# Altium project FIT_PM_Dual_Range_AFE.PrjPcb (part 7 of 8)

## Sheet FPGA_.SchDoc: FMC DAC 1.5GS 4CH
size 420 x 297 mm; Author: G.Kasprowicz; CompanyName: WUT ISE; DrawnBy: G.Kasprowicz; Organization: WUT ISE; Address1: PW ISE; Address2: Nowowiejska 15/19 00-665 Warsaw; Address3: gkasprow@gmail.com; Revision: 1; SheetNumber: 19; SheetTotal: 21; ModifiedBy: -; CheckedDate: -; Title2: FMC; DivGrp: WUT ISE; Designer: G.Kasprowicz; ModifiedDate: -; ProjectName: Sensor Box
Used 2 times, as channels U_FPGA_1, U_FPGA_2. Parts and nets are listed once, with the designators drawn on the sheet.
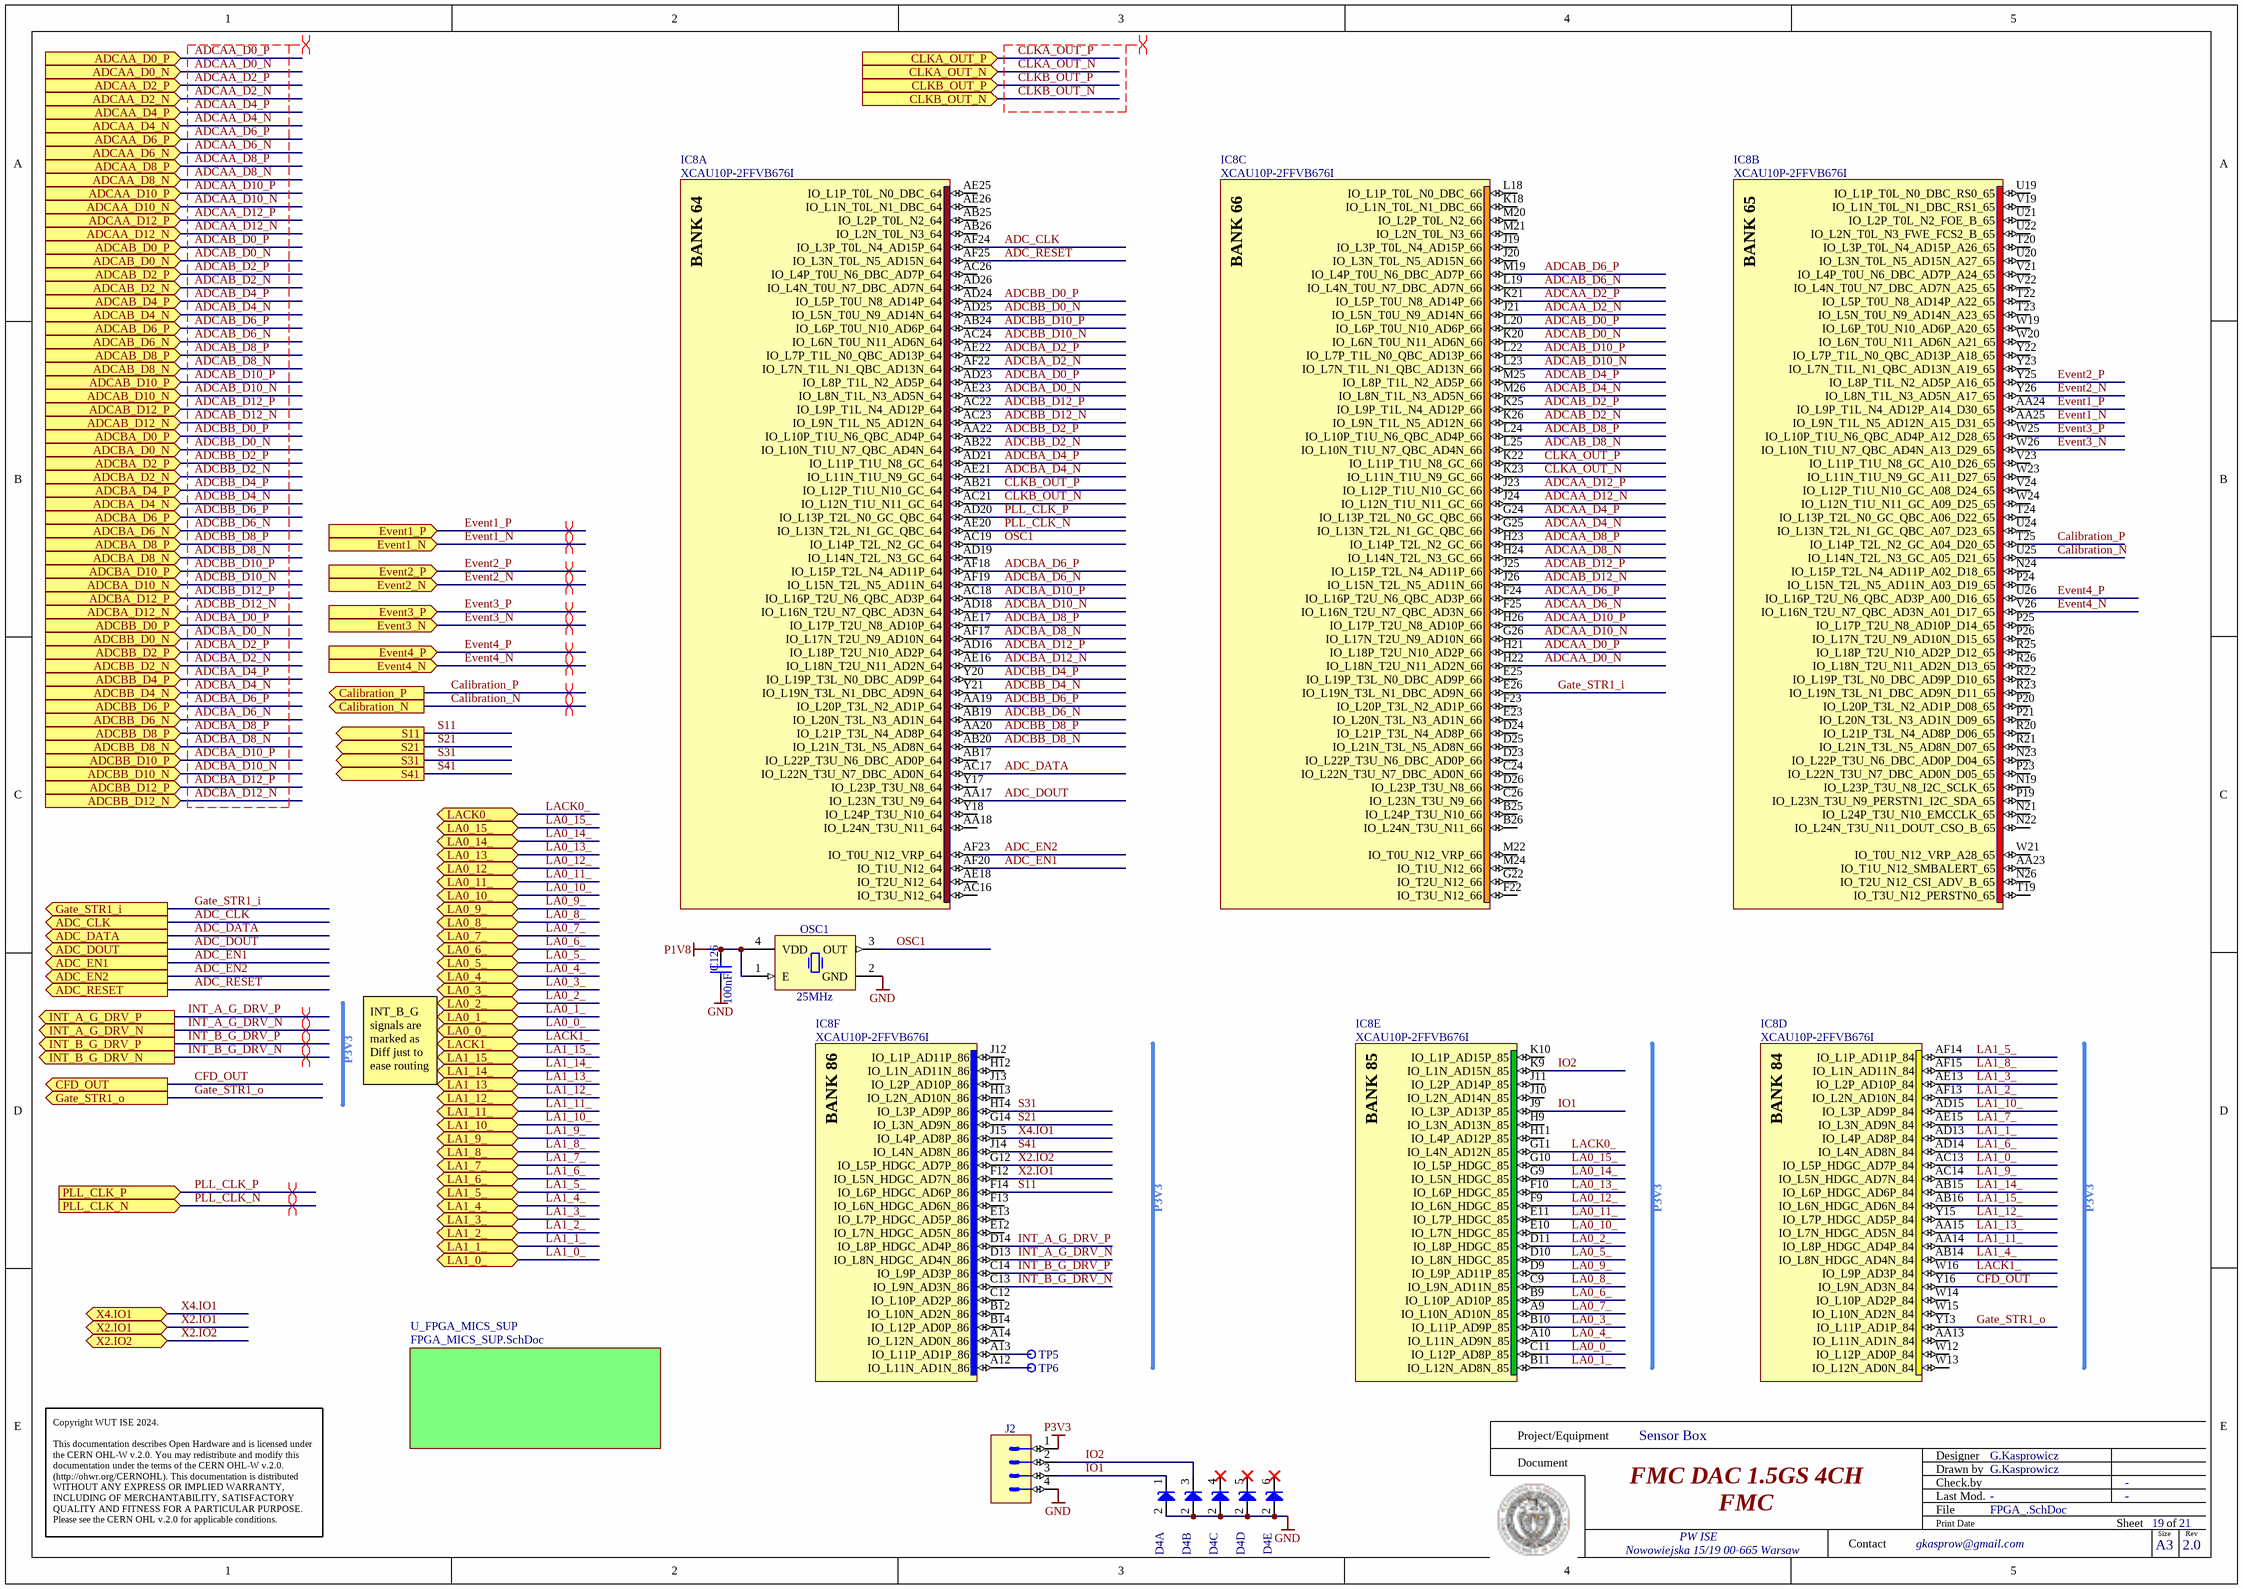
[diagram p19: FPGA_.SchDoc]

### Parts
C126  100nF  [CAPC1005X55N]
D4  PESD3V3L5UY  [SOT65P210X110-6N]  (value not drawn)  (parts A,B,C,D,E of 5)
IC8  XCAU10P-2FFVB676I  [BGA676C100P26X26_2700X2700X350]  (parts A,B,C,D,E,F of 13)
J2  Header 4  [SAMTEC_TSW-104-07-L-S-LL]  (value not drawn)
OSC1  25MHz  [OSC_ECS_ECS-3518]
TP5  Test Point  [TPS127]  (value not drawn)
TP6  Test Point  [TPS127]  (value not drawn)

### Sub-sheets
U_FPGA_MICS_SUP = FPGA_MICS_SUP.SchDoc: no entries

### Ports
ADC_CLK (out), ADC_DATA (out), ADC_DOUT (out), ADC_EN1 (out), ADC_EN2 (out), ADC_RESET (out), ADCAA_D0_N (in), ADCAA_D0_P (in), ADCAA_D2_N (in), ADCAA_D2_P (in), ADCAA_D4_N (in), ADCAA_D4_P (in), ADCAA_D6_N (in), ADCAA_D6_P (in), ADCAA_D8_N (in), ADCAA_D8_P (in), ADCAA_D10_N (in), ADCAA_D10_P (in), ADCAA_D12_N (in), ADCAA_D12_P (in), ADCAB_D0_N (in), ADCAB_D0_P (in), ADCAB_D2_N (in), ADCAB_D2_P (in), ADCAB_D4_N (in), ADCAB_D4_P (in), ADCAB_D6_N (in), ADCAB_D6_P (in), ADCAB_D8_N (in), ADCAB_D8_P (in), ADCAB_D10_N (in), ADCAB_D10_P (in), ADCAB_D12_N (in), ADCAB_D12_P (in), ADCBA_D0_N (in), ADCBA_D0_P (in), ADCBA_D2_N (in), ADCBA_D2_P (in), ADCBA_D4_N (in), ADCBA_D4_P (in), ADCBA_D6_N (in), ADCBA_D6_P (in), ADCBA_D8_N (in), ADCBA_D8_P (in), ADCBA_D10_N (in), ADCBA_D10_P (in), ADCBA_D12_N (in), ADCBA_D12_P (in), ADCBB_D0_N (in), ADCBB_D0_P (in), ADCBB_D2_N (in), ADCBB_D2_P (in), ADCBB_D4_N (in), ADCBB_D4_P (in), ADCBB_D6_N (in), ADCBB_D6_P (in), ADCBB_D8_N (in), ADCBB_D8_P (in), ADCBB_D10_N (in), ADCBB_D10_P (in), ADCBB_D12_N (in), ADCBB_D12_P (in), Calibration_N (out), Calibration_P (out), CFD_OUT (out), CLKA_OUT_N (in), CLKA_OUT_P (in), CLKB_OUT_N (in), CLKB_OUT_P (in), Event1_N (in), Event1_P (in), Event2_N (in), Event2_P (in), Event3_N (in), Event3_P (in), Event4_N (in), Event4_P (in), Gate_STR1_i (out), Gate_STR1_o (out), INT_A_G_DRV_N (out), INT_A_G_DRV_P (out), INT_B_G_DRV_N (out), INT_B_G_DRV_P (out), LA0_0_ (bidir), LA0_1_ (bidir), LA0_2_ (bidir), LA0_3_ (bidir), LA0_4_ (bidir), LA0_5_ (bidir), LA0_6_ (bidir), LA0_7_ (bidir), LA0_8_ (bidir), LA0_9_ (bidir), LA0_10_ (bidir), LA0_11_ (bidir), LA0_12_ (bidir), LA0_13_ (bidir), LA0_14_ (bidir), LA0_15_ (bidir), LA1_0_ (bidir), LA1_1_ (bidir), LA1_2_ (bidir), LA1_3_ (bidir), LA1_4_ (bidir), LA1_5_ (bidir), LA1_6_ (bidir), LA1_7_ (bidir), LA1_8_ (bidir), LA1_9_ (bidir), LA1_10_ (bidir), LA1_11_ (bidir), LA1_12_ (bidir), LA1_13_ (bidir), LA1_14_ (bidir), LA1_15_ (bidir), LACK0_ (bidir), LACK1_ (bidir), PLL_CLK_N (in), PLL_CLK_P (in), S11 (out), S21 (out), S31 (out), S41 (out), X2.IO1 (bidir), X2.IO2 (bidir), X4.IO1 (bidir)

### Nets
GND: C126.1 D4.2(A) J2.4 OSC1.2(GND)
P1V8: C126.2 OSC1.1(E) OSC1.4(VDD)
P3V3: J2.1
ADC_CLK: IC8.AF24(IO_L3P_T0L_N4_AD15P_64) ; port ADC_CLK
ADC_DATA: IC8.AC17(IO_L22N_T3U_N7_DBC_AD0N_64) ; port ADC_DATA
ADC_DOUT: IC8.AA17(IO_L23N_T3U_N9_64) ; port ADC_DOUT
ADC_EN1: IC8.AF20(IO_T1U_N12_64) ; port ADC_EN1
ADC_EN2: IC8.AF23(IO_T0U_N12_VRP_64) ; port ADC_EN2
ADC_RESET: IC8.AF25(IO_L3N_T0L_N5_AD15N_64) ; port ADC_RESET
ADCAA_D0_N: IC8.H22(IO_L18N_T2U_N11_AD2N_66) ; port ADCAA_D0_N
ADCAA_D0_P: IC8.H21(IO_L18P_T2U_N10_AD2P_66) ; port ADCAA_D0_P
ADCAA_D2_N: IC8.J21(IO_L5N_T0U_N9_AD14N_66) ; port ADCAA_D2_N
ADCAA_D2_P: IC8.K21(IO_L5P_T0U_N8_AD14P_66) ; port ADCAA_D2_P
ADCAA_D4_N: IC8.G25(IO_L13N_T2L_N1_GC_QBC_66) ; port ADCAA_D4_N
ADCAA_D4_P: IC8.G24(IO_L13P_T2L_N0_GC_QBC_66) ; port ADCAA_D4_P
ADCAA_D6_N: IC8.F25(IO_L16N_T2U_N7_QBC_AD3N_66) ; port ADCAA_D6_N
ADCAA_D6_P: IC8.F24(IO_L16P_T2U_N6_QBC_AD3P_66) ; port ADCAA_D6_P
ADCAA_D8_N: IC8.H24(IO_L14N_T2L_N3_GC_66) ; port ADCAA_D8_N
ADCAA_D8_P: IC8.H23(IO_L14P_T2L_N2_GC_66) ; port ADCAA_D8_P
ADCAA_D10_N: IC8.G26(IO_L17N_T2U_N9_AD10N_66) ; port ADCAA_D10_N
ADCAA_D10_P: IC8.H26(IO_L17P_T2U_N8_AD10P_66) ; port ADCAA_D10_P
ADCAA_D12_N: IC8.J24(IO_L12N_T1U_N11_GC_66) ; port ADCAA_D12_N
ADCAA_D12_P: IC8.J23(IO_L12P_T1U_N10_GC_66) ; port ADCAA_D12_P
ADCAB_D0_N: IC8.K20(IO_L6N_T0U_N11_AD6N_66) ; port ADCAB_D0_N
ADCAB_D0_P: IC8.L20(IO_L6P_T0U_N10_AD6P_66) ; port ADCAB_D0_P
ADCAB_D2_N: IC8.K26(IO_L9N_T1L_N5_AD12N_66) ; port ADCAB_D2_N
ADCAB_D2_P: IC8.K25(IO_L9P_T1L_N4_AD12P_66) ; port ADCAB_D2_P
ADCAB_D4_N: IC8.M26(IO_L8N_T1L_N3_AD5N_66) ; port ADCAB_D4_N
ADCAB_D4_P: IC8.M25(IO_L8P_T1L_N2_AD5P_66) ; port ADCAB_D4_P
ADCAB_D6_N: IC8.L19(IO_L4N_T0U_N7_DBC_AD7N_66) ; port ADCAB_D6_N
ADCAB_D6_P: IC8.M19(IO_L4P_T0U_N6_DBC_AD7P_66) ; port ADCAB_D6_P
ADCAB_D8_N: IC8.L25(IO_L10N_T1U_N7_QBC_AD4N_66) ; port ADCAB_D8_N
ADCAB_D8_P: IC8.L24(IO_L10P_T1U_N6_QBC_AD4P_66) ; port ADCAB_D8_P
ADCAB_D10_N: IC8.L23(IO_L7N_T1L_N1_QBC_AD13N_66) ; port ADCAB_D10_N
ADCAB_D10_P: IC8.L22(IO_L7P_T1L_N0_QBC_AD13P_66) ; port ADCAB_D10_P
ADCAB_D12_N: IC8.J26(IO_L15N_T2L_N5_AD11N_66) ; port ADCAB_D12_N
ADCAB_D12_P: IC8.J25(IO_L15P_T2L_N4_AD11P_66) ; port ADCAB_D12_P
ADCBA_D0_N: IC8.AE23(IO_L8N_T1L_N3_AD5N_64) ; port ADCBB_D0_N
ADCBA_D0_P: IC8.AD23(IO_L8P_T1L_N2_AD5P_64) ; port ADCBB_D0_P
ADCBA_D2_N: IC8.AF22(IO_L7N_T1L_N1_QBC_AD13N_64) ; port ADCBB_D2_N
ADCBA_D2_P: IC8.AE22(IO_L7P_T1L_N0_QBC_AD13P_64) ; port ADCBB_D2_P
ADCBA_D4_N: IC8.AE21(IO_L11N_T1U_N9_GC_64) ; port ADCBB_D4_N
ADCBA_D4_P: IC8.AD21(IO_L11P_T1U_N8_GC_64) ; port ADCBB_D4_P
ADCBA_D6_N: IC8.AF19(IO_L15N_T2L_N5_AD11N_64) ; port ADCBB_D6_N
ADCBA_D6_P: IC8.AF18(IO_L15P_T2L_N4_AD11P_64) ; port ADCBB_D6_P
ADCBA_D8_N: IC8.AF17(IO_L17N_T2U_N9_AD10N_64) ; port ADCBB_D8_N
ADCBA_D8_P: IC8.AE17(IO_L17P_T2U_N8_AD10P_64) ; port ADCBB_D8_P
ADCBA_D10_N: IC8.AD18(IO_L16N_T2U_N7_QBC_AD3N_64) ; port ADCBB_D10_N
ADCBA_D10_P: IC8.AC18(IO_L16P_T2U_N6_QBC_AD3P_64) ; port ADCBB_D10_P
ADCBA_D12_N: IC8.AE16(IO_L18N_T2U_N11_AD2N_64) ; port ADCBB_D12_N
ADCBA_D12_P: IC8.AD16(IO_L18P_T2U_N10_AD2P_64) ; port ADCBB_D12_P
ADCBB_D0_N: IC8.AD25(IO_L5N_T0U_N9_AD14N_64) ; port ADCBA_D0_N
ADCBB_D0_P: IC8.AD24(IO_L5P_T0U_N8_AD14P_64) ; port ADCBA_D0_P
ADCBB_D2_N: IC8.AB22(IO_L10N_T1U_N7_QBC_AD4N_64) ; port ADCBA_D2_N
ADCBB_D2_P: IC8.AA22(IO_L10P_T1U_N6_QBC_AD4P_64) ; port ADCBA_D2_P
ADCBB_D4_N: IC8.Y21(IO_L19N_T3L_N1_DBC_AD9N_64) ; port ADCBA_D4_N
ADCBB_D4_P: IC8.Y20(IO_L19P_T3L_N0_DBC_AD9P_64) ; port ADCBA_D4_P
ADCBB_D6_N: IC8.AB19(IO_L20N_T3L_N3_AD1N_64) ; port ADCBA_D6_N
ADCBB_D6_P: IC8.AA19(IO_L20P_T3L_N2_AD1P_64) ; port ADCBA_D6_P
ADCBB_D8_N: IC8.AB20(IO_L21N_T3L_N5_AD8N_64) ; port ADCBA_D8_N
ADCBB_D8_P: IC8.AA20(IO_L21P_T3L_N4_AD8P_64) ; port ADCBA_D8_P
ADCBB_D10_N: IC8.AC24(IO_L6N_T0U_N11_AD6N_64) ; port ADCBA_D10_N
ADCBB_D10_P: IC8.AB24(IO_L6P_T0U_N10_AD6P_64) ; port ADCBA_D10_P
ADCBB_D12_N: IC8.AC23(IO_L9N_T1L_N5_AD12N_64) ; port ADCBA_D12_N
ADCBB_D12_P: IC8.AC22(IO_L9P_T1L_N4_AD12P_64) ; port ADCBA_D12_P
Calibration_N: IC8.U25(IO_L14N_T2L_N3_GC_A05_D21_65) ; port Calibration_N
Calibration_P: IC8.T25(IO_L14P_T2L_N2_GC_A04_D20_65) ; port Calibration_P
CFD_OUT: IC8.Y16(IO_L9N_AD3N_84) ; port CFD_OUT
CLKA_OUT_N: IC8.K23(IO_L11N_T1U_N9_GC_66) ; port CLKA_OUT_N
CLKA_OUT_P: IC8.K22(IO_L11P_T1U_N8_GC_66) ; port CLKA_OUT_P
CLKB_OUT_N: IC8.AC21(IO_L12N_T1U_N11_GC_64) ; port CLKB_OUT_N
CLKB_OUT_P: IC8.AB21(IO_L12P_T1U_N10_GC_64) ; port CLKB_OUT_P
Event1_N: IC8.AA25(IO_L9N_T1L_N5_AD12N_A15_D31_65) ; port Event1_N
Event1_P: IC8.AA24(IO_L9P_T1L_N4_AD12P_A14_D30_65) ; port Event1_P
Event2_N: IC8.Y26(IO_L8N_T1L_N3_AD5N_A17_65) ; port Event2_N
Event2_P: IC8.Y25(IO_L8P_T1L_N2_AD5P_A16_65) ; port Event2_P
Event3_N: IC8.W26(IO_L10N_T1U_N7_QBC_AD4N_A13_D29_65) ; port Event3_N
Event3_P: IC8.W25(IO_L10P_T1U_N6_QBC_AD4P_A12_D28_65) ; port Event3_P
Event4_N: IC8.V26(IO_L16N_T2U_N7_QBC_AD3N_A01_D17_65) ; port Event4_N
Event4_P: IC8.U26(IO_L16P_T2U_N6_QBC_AD3P_A00_D16_65) ; port Event4_P
Gate_STR1_i: IC8.E26(IO_L19N_T3L_N1_DBC_AD9N_66) ; port Gate_STR1_i
Gate_STR1_o: IC8.Y13(IO_L11P_AD1P_84) ; port Gate_STR1_o
INT_A_G_DRV_N: IC8.D13(IO_L8N_HDGC_AD4N_86) ; port INT_A_G_DRV_N
INT_A_G_DRV_P: IC8.D14(IO_L8P_HDGC_AD4P_86) ; port INT_A_G_DRV_P
INT_B_G_DRV_N: IC8.C13(IO_L9N_AD3N_86) ; port INT_B_G_DRV_N
INT_B_G_DRV_P: IC8.C14(IO_L9P_AD3P_86) ; port INT_B_G_DRV_P
IO1: D4.1(C) IC8.J9(IO_L3P_AD13P_85) J2.3
IO2: D4.3(C) IC8.K9(IO_L1N_AD15N_85) J2.2
LA0_0_: IC8.C11(IO_L12P_AD8P_85) ; port LA0_0_
LA0_1_: IC8.B11(IO_L12N_AD8N_85) ; port LA0_1_
LA0_2_: IC8.D11(IO_L8P_HDGC_85) ; port LA0_2_
LA0_3_: IC8.B10(IO_L11P_AD9P_85) ; port LA0_3_
LA0_4_: IC8.A10(IO_L11N_AD9N_85) ; port LA0_4_
LA0_5_: IC8.D10(IO_L8N_HDGC_85) ; port LA0_5_
LA0_6_: IC8.B9(IO_L10P_AD10P_85) ; port LA0_6_
LA0_7_: IC8.A9(IO_L10N_AD10N_85) ; port LA0_7_
LA0_8_: IC8.C9(IO_L9N_AD11N_85) ; port LA0_8_
LA0_9_: IC8.D9(IO_L9P_AD11P_85) ; port LA0_9_
LA0_10_: IC8.E10(IO_L7N_HDGC_85) ; port LA0_10_
LA0_11_: IC8.E11(IO_L7P_HDGC_85) ; port LA0_11_
LA0_12_: IC8.F9(IO_L6N_HDGC_85) ; port LA0_12_
LA0_13_: IC8.F10(IO_L6P_HDGC_85) ; port LA0_13_
LA0_14_: IC8.G9(IO_L5N_HDGC_85) ; port LA0_14_
LA0_15_: IC8.G10(IO_L5P_HDGC_85) ; port LA0_15_
LA1_0_: IC8.AC13(IO_L5P_HDGC_AD7P_84) ; port LA1_0_
LA1_1_: IC8.AD13(IO_L4P_AD8P_84) ; port LA1_1_
LA1_2_: IC8.AF13(IO_L2N_AD10N_84) ; port LA1_2_
LA1_3_: IC8.AE13(IO_L2P_AD10P_84) ; port LA1_3_
LA1_4_: IC8.AB14(IO_L8N_HDGC_AD4N_84) ; port LA1_4_
LA1_5_: IC8.AF14(IO_L1P_AD11P_84) ; port LA1_5_
LA1_6_: IC8.AD14(IO_L4N_AD8N_84) ; port LA1_6_
LA1_7_: IC8.AE15(IO_L3N_AD9N_84) ; port LA1_7_
LA1_8_: IC8.AF15(IO_L1N_AD11N_84) ; port LA1_8_
LA1_9_: IC8.AC14(IO_L5N_HDGC_AD7N_84) ; port LA1_9_
LA1_10_: IC8.AD15(IO_L3P_AD9P_84) ; port LA1_10_
LA1_11_: IC8.AA14(IO_L8P_HDGC_AD4P_84) ; port LA1_11_
LA1_12_: IC8.Y15(IO_L7P_HDGC_AD5P_84) ; port LA1_12_
LA1_13_: IC8.AA15(IO_L7N_HDGC_AD5N_84) ; port LA1_13_
LA1_14_: IC8.AB15(IO_L6P_HDGC_AD6P_84) ; port LA1_14_
LA1_15_: IC8.AB16(IO_L6N_HDGC_AD6N_84) ; port LA1_15_
LACK0_: IC8.G11(IO_L4N_AD12N_85) ; port LACK0_
LACK1_: IC8.W16(IO_L9P_AD3P_84) ; port LACK1_
OSC1: IC8.AC19(IO_L14P_T2L_N2_GC_64) OSC1.3(OUT)
PLL_CLK_N: IC8.AE20(IO_L13N_T2L_N1_GC_QBC_64) ; port PLL_CLK_N
PLL_CLK_P: IC8.AD20(IO_L13P_T2L_N0_GC_QBC_64) ; port PLL_CLK_P
S11: IC8.F14(IO_L6P_HDGC_AD6P_86) ; port S11
S21: IC8.G14(IO_L3N_AD9N_86) ; port S21
S31: IC8.H14(IO_L3P_AD9P_86) ; port S31
S41: IC8.J14(IO_L4N_AD8N_86) ; port S41
X2.IO1: IC8.F12(IO_L5N_HDGC_AD7N_86) ; port X2.IO1
X2.IO2: IC8.G12(IO_L5P_HDGC_AD7P_86) ; port X2.IO2
X4.IO1: IC8.J15(IO_L4P_AD8P_86) ; port X4.IO1
NetIC8_A12: IC8.A12(IO_L11N_AD1N_86) TP6.1
NetIC8_A13: IC8.A13(IO_L11P_AD1P_86) TP5.1

Not connected (* = marked no-connect by the designer): D4 4(C)* 5(C)* 6(C)*; IC8 A14(IO_L12N_AD0N_86) AA13(IO_L11N_AD1N_84) AA18(IO_L24N_T3U_N11_64) AA23(IO_T1U_N12_SMBALERT_65) AB17(IO_L22P_T3U_N6_DBC_AD0P_64) AB25(IO_L2P_T0L_N2_64) AB26(IO_L2N_T0L_N3_64) AC16(IO_T3U_N12_64) AC26(IO_L4P_T0U_N6_DBC_AD7P_64) AD19(IO_L14N_T2L_N3_GC_64) AD26(IO_L4N_T0U_N7_DBC_AD7N_64) AE18(IO_T2U_N12_64) AE25(IO_L1P_T0L_N0_DBC_64) AE26(IO_L1N_T0L_N1_DBC_64) B12(IO_L10N_AD2N_86) B14(IO_L12P_AD0P_86) B25(IO_L24P_T3U_N10_66) B26(IO_L24N_T3U_N11_66) C12(IO_L10P_AD2P_86) C24(IO_L22N_T3U_N7_DBC_AD0N_66) C26(IO_L23N_T3U_N9_66) D23(IO_L22P_T3U_N6_DBC_AD0P_66) D24(IO_L21P_T3L_N4_AD8P_66) D25(IO_L21N_T3L_N5_AD8N_66) D26(IO_L23P_T3U_N8_66) E12(IO_L7N_HDGC_AD5N_86) E13(IO_L7P_HDGC_AD5P_86) E23(IO_L20N_T3L_N3_AD1N_66) E25(IO_L19P_T3L_N0_DBC_AD9P_66) F13(IO_L6N_HDGC_AD6N_86) F22(IO_T3U_N12_66) F23(IO_L20P_T3L_N2_AD1P_66) G22(IO_T2U_N12_66) H9(IO_L3N_AD13N_85) H11(IO_L4P_AD12P_85) H12(IO_L1N_AD11N_86) H13(IO_L2N_AD10N_86) J10(IO_L2N_AD14N_85) J11(IO_L2P_AD14P_85) J12(IO_L1P_AD11P_86) J13(IO_L2P_AD10P_86) J19(IO_L3P_T0L_N4_AD15P_66) J20(IO_L3N_T0L_N5_AD15N_66) K10(IO_L1P_AD15P_85) K18(IO_L1N_T0L_N1_DBC_66) L18(IO_L1P_T0L_N0_DBC_66) M20(IO_L2P_T0L_N2_66) M21(IO_L2N_T0L_N3_66) M22(IO_T0U_N12_VRP_66) M24(IO_T1U_N12_66) N19(IO_L23P_T3U_N8_I2C_SCLK_65) N21(IO_L24P_T3U_N10_EMCCLK_65) N22(IO_L24N_T3U_N11_DOUT_CSO_B_65) N23(IO_L22P_T3U_N6_DBC_AD0P_D04_65) N24(IO_L15P_T2L_N4_AD11P_A02_D18_65) N26(IO_T2U_N12_CSI_ADV_B_65) P19(IO_L23N_T3U_N9_PERSTN1_I2C_SDA_65) P20(IO_L20P_T3L_N2_AD1P_D08_65) P21(IO_L20N_T3L_N3_AD1N_D09_65) P23(IO_L22N_T3U_N7_DBC_AD0N_D05_65) P24(IO_L15N_T2L_N5_AD11N_A03_D19_65) P25(IO_L17P_T2U_N8_AD10P_D14_65) P26(IO_L17N_T2U_N9_AD10N_D15_65) R20(IO_L21P_T3L_N4_AD8P_D06_65) R21(IO_L21N_T3L_N5_AD8N_D07_65) R22(IO_L19P_T3L_N0_DBC_AD9P_D10_65) R23(IO_L19N_T3L_N1_DBC_AD9N_D11_65) R25(IO_L18P_T2U_N10_AD2P_D12_65) R26(IO_L18N_T2U_N11_AD2N_D13_65) T19(IO_T3U_N12_PERSTN0_65) T20(IO_L3P_T0L_N4_AD15P_A26_65) T22(IO_L5P_T0U_N8_AD14P_A22_65) T23(IO_L5N_T0U_N9_AD14N_A23_65) T24(IO_L13P_T2L_N0_GC_QBC_A06_D22_65) U19(IO_L1P_T0L_N0_DBC_RS0_65) U20(IO_L3N_T0L_N5_AD15N_A27_65) U21(IO_L2P_T0L_N2_FOE_B_65) U22(IO_L2N_T0L_N3_FWE_FCS2_B_65) U24(IO_L13N_T2L_N1_GC_QBC_A07_D23_65) V19(IO_L1N_T0L_N1_DBC_RS1_65) V21(IO_L4P_T0U_N6_DBC_AD7P_A24_65) V22(IO_L4N_T0U_N7_DBC_AD7N_A25_65) V23(IO_L11P_T1U_N8_GC_A10_D26_65) V24(IO_L12P_T1U_N10_GC_A08_D24_65) W12(IO_L12P_AD0P_84) W13(IO_L12N_AD0N_84) W14(IO_L10P_AD2P_84) W15(IO_L10N_AD2N_84) W19(IO_L6P_T0U_N10_AD6P_A20_65) W20(IO_L6N_T0U_N11_AD6N_A21_65) W21(IO_T0U_N12_VRP_A28_65) W23(IO_L11N_T1U_N9_GC_A11_D27_65) W24(IO_L12N_T1U_N11_GC_A09_D25_65) Y17(IO_L23P_T3U_N8_64) Y18(IO_L24P_T3U_N10_64) Y22(IO_L7P_T1L_N0_QBC_AD13P_A18_65) Y23(IO_L7N_T1L_N1_QBC_AD13N_A19_65)

### Channels
U_FPGA_1: designators C126=C78A#2 D4=D4A IC8=IC8A#1 J2=J2A OSC1=OSC1A TP5=TP5A TP6=TP6A; ports ADC_CLK=ADC_CLK_U_FPGA_1 ADC_DATA=ADC_DATA_U_FPGA_1 ADC_DOUT=ADC_DOUT_U_FPGA_1 ADC_EN1=ADC_EN1_U_FPGA_1 ADC_EN2=ADC_EN2_U_FPGA_1 ADC_RESET=ADC_RESET_U_FPGA_1 ADCAA_D0_N=ADCAA_D0_N_U_FPGA_1 ADCAA_D0_P=ADCAA_D0_P_U_FPGA_1 ADCAA_D2_N=ADCAA_D2_N_U_FPGA_1 ADCAA_D2_P=ADCAA_D2_P_U_FPGA_1 ADCAA_D4_N=ADCAA_D4_N_U_FPGA_1 ADCAA_D4_P=ADCAA_D4_P_U_FPGA_1 ADCAA_D6_N=ADCAA_D6_N_U_FPGA_1 ADCAA_D6_P=ADCAA_D6_P_U_FPGA_1 ADCAA_D8_N=ADCAA_D8_N_U_FPGA_1 ADCAA_D8_P=ADCAA_D8_P_U_FPGA_1 ADCAA_D10_N=ADCAA_D10_N_U_FPGA_1 ADCAA_D10_P=ADCAA_D10_P_U_FPGA_1 ADCAA_D12_N=ADCAA_D12_N_U_FPGA_1 ADCAA_D12_P=ADCAA_D12_P_U_FPGA_1 ADCAB_D0_N=ADCAB_D0_N_U_FPGA_1 ADCAB_D0_P=ADCAB_D0_P_U_FPGA_1 ADCAB_D2_N=ADCAB_D2_N_U_FPGA_1 ADCAB_D2_P=ADCAB_D2_P_U_FPGA_1 ADCAB_D4_N=ADCAB_D4_N_U_FPGA_1 ADCAB_D4_P=ADCAB_D4_P_U_FPGA_1 ADCAB_D6_N=ADCAB_D6_N_U_FPGA_1 ADCAB_D6_P=ADCAB_D6_P_U_FPGA_1 ADCAB_D8_N=ADCAB_D8_N_U_FPGA_1 ADCAB_D8_P=ADCAB_D8_P_U_FPGA_1 ADCAB_D10_N=ADCAB_D10_N_U_FPGA_1 ADCAB_D10_P=ADCAB_D10_P_U_FPGA_1 ADCAB_D12_N=ADCAB_D12_N_U_FPGA_1 ADCAB_D12_P=ADCAB_D12_P_U_FPGA_1 ADCBA_D0_N=ADCBA_D0_N1 ADCBA_D0_P=ADCBA_D0_P1 ADCBA_D2_N=ADCBA_D2_N1 ADCBA_D2_P=ADCBA_D2_P1 ADCBA_D4_N=ADCBA_D4_N1 ADCBA_D4_P=ADCBA_D4_P1 ADCBA_D6_N=ADCBA_D6_N1 ADCBA_D6_P=ADCBA_D6_P1 ADCBA_D8_N=ADCBA_D8_N1 ADCBA_D8_P=ADCBA_D8_P1 ADCBA_D10_N=ADCBA_D10_N1 ADCBA_D10_P=ADCBA_D10_P1 ADCBA_D12_N=ADCBA_D12_N1 ADCBA_D12_P=ADCBA_D12_P1 ADCBB_D0_N=ADCBA_D0_N_U_FPGA_1 ADCBB_D0_P=ADCBA_D0_P_U_FPGA_1 ADCBB_D2_N=ADCBA_D2_N_U_FPGA_1 ADCBB_D2_P=ADCBA_D2_P_U_FPGA_1 ADCBB_D4_N=ADCBA_D4_N_U_FPGA_1 ADCBB_D4_P=ADCBA_D4_P_U_FPGA_1 ADCBB_D6_N=ADCBA_D6_N_U_FPGA_1 ADCBB_D6_P=ADCBA_D6_P_U_FPGA_1 ADCBB_D8_N=ADCBA_D8_N_U_FPGA_1 ADCBB_D8_P=ADCBA_D8_P_U_FPGA_1 ADCBB_D10_N=ADCBA_D10_N_U_FPGA_1 ADCBB_D10_P=ADCBA_D10_P_U_FPGA_1 ADCBB_D12_N=ADCBA_D12_N_U_FPGA_1 ADCBB_D12_P=ADCBA_D12_P_U_FPGA_1 Calibration_N=Calibration_N_U_FPGA_1 Calibration_P=Calibration_P_U_FPGA_1 CFD_OUT=CFD_OUT_U_FPGA_1 CLKA_OUT_N=CLKA_OUT_N_U_FPGA_1 CLKA_OUT_P=CLKA_OUT_P_U_FPGA_1 CLKB_OUT_N=CLKB_OUT_N_U_FPGA_1 CLKB_OUT_P=CLKB_OUT_P_U_FPGA_1 Event1_N=Event1_N_U_FPGA_1 Event1_P=Event1_P_U_FPGA_1 Event2_N=Event2_N_U_FPGA_1 Event2_P=Event2_P_U_FPGA_1 Event3_N=Event3_N_U_FPGA_1 Event3_P=Event3_P_U_FPGA_1 Event4_N=Event4_N_U_FPGA_1 Event4_P=Event4_P_U_FPGA_1 Gate_STR1_i=Gate_STR1_i_U_FPGA_1 Gate_STR1_o=Gate_STR1_o_U_FPGA_1 INT_A_G_DRV_N=INT_A_G_DRV_N_U_FPGA_1 INT_A_G_DRV_P=INT_A_G_DRV_P_U_FPGA_1 INT_B_G_DRV_N=INT_B_G_DRV_N_U_FPGA_1 INT_B_G_DRV_P=INT_B_G_DRV_P_U_FPGA_1 LA0_0_=LA0_0_ LA0_1_=LA0_1_ LA0_2_=LA0_2_ LA0_3_=LA0_3_ LA0_4_=LA0_4_ LA0_5_=LA0_5_ LA0_6_=LA0_6_ LA0_7_=LA0_7_ LA0_8_=LA0_8_ LA0_9_=LA0_9_ LA0_10_=LA0_10_ LA0_11_=LA0_11_ LA0_12_=LA0_12_ LA0_13_=LA0_13_ LA0_14_=LA0_14_ LA0_15_=LA0_15_ LA1_0_=LA1_0_ LA1_1_=LA1_1_ LA1_2_=LA1_2_ LA1_3_=LA1_3_ LA1_4_=LA1_4_ LA1_5_=LA1_5_ LA1_6_=LA1_6_ LA1_7_=LA1_7_ LA1_8_=LA1_8_ LA1_9_=LA1_9_ LA1_10_=LA1_10_ LA1_11_=LA1_11_ LA1_12_=LA1_12_ LA1_13_=LA1_13_ LA1_14_=LA1_14_ LA1_15_=LA1_15_ LACK0_=LACK0_ LACK1_=LACK1_ PLL_CLK_N=PLL_CLK_N PLL_CLK_P=PLL_CLK_P S11=S11_U_FPGA_1 S21=S21_U_FPGA_1 S31=S31_U_FPGA_1 S41=S41_U_FPGA_1 X2.IO1=X2.IO1_U_FPGA_1 X2.IO2=X2.IO2_U_FPGA_1 X4.IO1=X4.IO1_U_FPGA_1
U_FPGA_2: designators C126=C78B#2 D4=D4B IC8=IC8B#2 J2=J2B OSC1=OSC1B TP5=TP5B TP6=TP6B; ports ADC_CLK=ADC_CLK_U_FPGA_2 ADC_DATA=ADC_DATA_U_FPGA_2 ADC_DOUT=ADC_DOUT_U_FPGA_2 ADC_EN1=ADC_EN1_U_FPGA_2 ADC_EN2=ADC_EN2_U_FPGA_2 ADC_RESET=ADC_RESET_U_FPGA_2 ADCAA_D0_N=ADCAA_D0_N_U_FPGA_2 ADCAA_D0_P=ADCAA_D0_P_U_FPGA_2 ADCAA_D2_N=ADCAA_D2_N_U_FPGA_2 ADCAA_D2_P=ADCAA_D2_P_U_FPGA_2 ADCAA_D4_N=ADCAA_D4_N_U_FPGA_2 ADCAA_D4_P=ADCAA_D4_P_U_FPGA_2 ADCAA_D6_N=ADCAA_D6_N_U_FPGA_2 ADCAA_D6_P=ADCAA_D6_P_U_FPGA_2 ADCAA_D8_N=ADCAA_D8_N_U_FPGA_2 ADCAA_D8_P=ADCAA_D8_P_U_FPGA_2 ADCAA_D10_N=ADCAA_D10_N_U_FPGA_2 ADCAA_D10_P=ADCAA_D10_P_U_FPGA_2 ADCAA_D12_N=ADCAA_D12_N_U_FPGA_2 ADCAA_D12_P=ADCAA_D12_P_U_FPGA_2 ADCAB_D0_N=ADCAB_D0_N_U_FPGA_2 ADCAB_D0_P=ADCAB_D0_P_U_FPGA_2 ADCAB_D2_N=ADCAB_D2_N_U_FPGA_2 ADCAB_D2_P=ADCAB_D2_P_U_FPGA_2 ADCAB_D4_N=ADCAB_D4_N_U_FPGA_2 ADCAB_D4_P=ADCAB_D4_P_U_FPGA_2 ADCAB_D6_N=ADCAB_D6_N_U_FPGA_2 ADCAB_D6_P=ADCAB_D6_P_U_FPGA_2 ADCAB_D8_N=ADCAB_D8_N_U_FPGA_2 ADCAB_D8_P=ADCAB_D8_P_U_FPGA_2 ADCAB_D10_N=ADCAB_D10_N_U_FPGA_2 ADCAB_D10_P=ADCAB_D10_P_U_FPGA_2 ADCAB_D12_N=ADCAB_D12_N_U_FPGA_2 ADCAB_D12_P=ADCAB_D12_P_U_FPGA_2 ADCBA_D0_N=ADCBA_D0_N2 ADCBA_D0_P=ADCBA_D0_P2 ADCBA_D2_N=ADCBA_D2_N2 ADCBA_D2_P=ADCBA_D2_P2 ADCBA_D4_N=ADCBA_D4_N2 ADCBA_D4_P=ADCBA_D4_P2 ADCBA_D6_N=ADCBA_D6_N2 ADCBA_D6_P=ADCBA_D6_P2 ADCBA_D8_N=ADCBA_D8_N2 ADCBA_D8_P=ADCBA_D8_P2 ADCBA_D10_N=ADCBA_D10_N2 ADCBA_D10_P=ADCBA_D10_P2 ADCBA_D12_N=ADCBA_D12_N2 ADCBA_D12_P=ADCBA_D12_P2 ADCBB_D0_N=ADCBA_D0_N_U_FPGA_2 ADCBB_D0_P=ADCBA_D0_P_U_FPGA_2 ADCBB_D2_N=ADCBA_D2_N_U_FPGA_2 ADCBB_D2_P=ADCBA_D2_P_U_FPGA_2 ADCBB_D4_N=ADCBA_D4_N_U_FPGA_2 ADCBB_D4_P=ADCBA_D4_P_U_FPGA_2 ADCBB_D6_N=ADCBA_D6_N_U_FPGA_2 ADCBB_D6_P=ADCBA_D6_P_U_FPGA_2 ADCBB_D8_N=ADCBA_D8_N_U_FPGA_2 ADCBB_D8_P=ADCBA_D8_P_U_FPGA_2 ADCBB_D10_N=ADCBA_D10_N_U_FPGA_2 ADCBB_D10_P=ADCBA_D10_P_U_FPGA_2 ADCBB_D12_N=ADCBA_D12_N_U_FPGA_2 ADCBB_D12_P=ADCBA_D12_P_U_FPGA_2 Calibration_N=Calibration_N_U_FPGA_2 Calibration_P=Calibration_P_U_FPGA_2 CFD_OUT=CFD_OUT_U_FPGA_2 CLKA_OUT_N=CLKA_OUT_N_U_FPGA_2 CLKA_OUT_P=CLKA_OUT_P_U_FPGA_2 CLKB_OUT_N=CLKB_OUT_N_U_FPGA_2 CLKB_OUT_P=CLKB_OUT_P_U_FPGA_2 Event1_N=Event1_N_U_FPGA_2 Event1_P=Event1_P_U_FPGA_2 Event2_N=Event2_N_U_FPGA_2 Event2_P=Event2_P_U_FPGA_2 Event3_N=Event3_N_U_FPGA_2 Event3_P=Event3_P_U_FPGA_2 Event4_N=Event4_N_U_FPGA_2 Event4_P=Event4_P_U_FPGA_2 Gate_STR1_i=Gate_STR1_i_U_FPGA_2 Gate_STR1_o=Gate_STR1_o_U_FPGA_2 INT_A_G_DRV_N=INT_A_G_DRV_N_U_FPGA_2 INT_A_G_DRV_P=INT_A_G_DRV_P_U_FPGA_2 INT_B_G_DRV_N=INT_B_G_DRV_N_U_FPGA_2 INT_B_G_DRV_P=INT_B_G_DRV_P_U_FPGA_2 LA0_0_=LA0_0_ LA0_1_=LA0_1_ LA0_2_=LA0_2_ LA0_3_=LA0_3_ LA0_4_=LA0_4_ LA0_5_=LA0_5_ LA0_6_=LA0_6_ LA0_7_=LA0_7_ LA0_8_=LA0_8_ LA0_9_=LA0_9_ LA0_10_=LA0_10_ LA0_11_=LA0_11_ LA0_12_=LA0_12_ LA0_13_=LA0_13_ LA0_14_=LA0_14_ LA0_15_=LA0_15_ LA1_0_=LA1_0_ LA1_1_=LA1_1_ LA1_2_=LA1_2_ LA1_3_=LA1_3_ LA1_4_=LA1_4_ LA1_5_=LA1_5_ LA1_6_=LA1_6_ LA1_7_=LA1_7_ LA1_8_=LA1_8_ LA1_9_=LA1_9_ LA1_10_=LA1_10_ LA1_11_=LA1_11_ LA1_12_=LA1_12_ LA1_13_=LA1_13_ LA1_14_=LA1_14_ LA1_15_=LA1_15_ LACK0_=LACK0_ LACK1_=LACK1_ PLL_CLK_N=PLL_CLK_N PLL_CLK_P=PLL_CLK_P S11=S11_U_FPGA_2 S21=S21_U_FPGA_2 S31=S31_U_FPGA_2 S41=S41_U_FPGA_2 X2.IO1=X2.IO1_U_FPGA_2 X2.IO2=X2.IO2_U_FPGA_2 X4.IO1=X4.IO1_U_FPGA_2

### Layout directives
differential pair; differential pair class D100: ADCAA_D0_N, ADCAA_D0_P, ADCAA_D2_N, ADCAA_D2_P, ADCAA_D4_N, ADCAA_D4_P, ADCAA_D6_N, ADCAA_D6_P, ADCAA_D8_N, ADCAA_D8_P, ADCAA_D10_N, ADCAA_D10_P, ADCAA_D12_N, ADCAA_D12_P, ADCAB_D0_N, ADCAB_D0_P, ADCAB_D2_N, ADCAB_D2_P, ADCAB_D4_N, ADCAB_D4_P, ADCAB_D6_N, ADCAB_D6_P, ADCAB_D8_N, ADCAB_D8_P, ADCAB_D10_N, ADCAB_D10_P, ADCAB_D12_N, ADCAB_D12_P, ADCBA_D0_N, ADCBA_D0_P, ADCBA_D2_N, ADCBA_D2_P, ADCBA_D4_N, ADCBA_D4_P, ADCBA_D6_N, ADCBA_D6_P, ADCBA_D8_N, ADCBA_D8_P, ADCBA_D10_N, ADCBA_D10_P, ADCBA_D12_N, ADCBA_D12_P, ADCBB_D0_N, ADCBB_D0_P, ADCBB_D2_N, ADCBB_D2_P, ADCBB_D4_N, ADCBB_D4_P, ADCBB_D6_N, ADCBB_D6_P, ADCBB_D8_N, ADCBB_D8_P, ADCBB_D10_N, ADCBB_D10_P, ADCBB_D12_N, ADCBB_D12_P, Calibration_N_U_FPGA_1, Calibration_P_U_FPGA_1, CLKA_OUT_N, CLKA_OUT_P, CLKB_OUT_N, CLKB_OUT_P, Event1_N_U_FPGA_1, Event1_P_U_FPGA_1, Event2_N_U_FPGA_1, Event2_P_U_FPGA_1, Event3_N_U_FPGA_1, Event3_P_U_FPGA_1, Event4_N_U_FPGA_1, Event4_P_U_FPGA_1, INT_A_G_DRV_N_U_FPGA_1, INT_A_G_DRV_P_U_FPGA_1, INT_B_G_DRV_N_U_FPGA_1, INT_B_G_DRV_P_U_FPGA_1, PLL_CLK_N, PLL_CLK_P

### Notes on the sheet
- P3V3
- INT_B_G signals are marked as Diff just to ease routing
- Project/Equipment
- Document
- Designer
- Drawn by
- Check.by
- Copyright WUT ISE 2024.
  This documentation describes Open Hardware and is licensed under the CERN OHL-W v.2.0. You may redistribute and modify this documentation under the terms of the CERN OHL-W v.2.0. (http://ohwr.org/CERNOHL). This documentation is distributed WITHOUT ANY EXPRESS OR IMPLIED WARRANTY, INCLUDING OF MERCHANTABILITY, SATISFACTORY QUALITY AND FITNESS FOR A PARTICULAR PURPOSE. Please see the CERN OHL v.2.0 for applicable conditions.
- Contact
- File
- Last Mod.
- Print Date
- Sheet
- Size
- A3
- of
- Rev
- (in symbol XCAU10P-2FFVB676I, part A) BANK 64
- (in symbol XCAU10P-2FFVB676I, part B) BANK 65
- (in symbol XCAU10P-2FFVB676I, part C) BANK 66
- (in symbol XCAU10P-2FFVB676I, part D) BANK 84
- (in symbol XCAU10P-2FFVB676I, part E) BANK 85
- (in symbol XCAU10P-2FFVB676I, part F) BANK 86

### Library data of the parts
C126 = CC0402_100NF_16V_10%_X5R: Non-polarised capacitor; Part Description: SMD Multilayer Chip Ceramic Capacitor; Manufacturer: GENERIC; Manufacturer1 Part Number: GRM155R61C104KA88D; Voltage: 16V; TC: X5R; Tolerance: ±10%; Part Number: CC0402_100NF_16V_10%_X5R; Component Kind: Standard; Component Type: Standard; Pin Count: 2; Value: 100nF; Status: None; Manufacturer Part Number: CC0402_100NF_16V_10%_X5R; Case: 0402; Mounted: Yes; Socket: No; SMD: Yes; Sense: No; Manufacturer1 Example: MURATA; Manufacturer1 ComponentHeight: 0.55mm; HelpURL: \\cern.ch\dfs\Applications\Altium\Datasheets\CC0402_X5R_MURATA_GRM.pdf; Author: CERN DEM JLC; CreateDate: 10.12.2013; LatestRevisionDate: 10.12.2013
D4 = PESD3V3L5UY: Fivefold ESD Protection Diode Arrays; Part Description: Fivefold ESD Protection Diode Arrays (30kV); Manufacturer: NEXPERIA; Voltage: 3.3V; Power: 200W; PressFit: No; Bonding: No; Part Number: PESD3V3L5UY; Component Kind: Standard; Component Type: Standard; Device: PESD3V3L5UY; PackageDescription: SOT363, SC-88, 0.65mm Pitch; 6 Pin, 1.25mm W X 2.00mm L X 1.10mm H body, IPC Medium Density; Manufacturer Part Number: PESD3V3L5UY; Pin Count: 6; Case: SOT363; Mounted: Yes; Socket: No; SMD: Yes; Sense: No; ComponentHeight: 1.1mm; HelpURL: \\cern.ch\dfs\Applications\Altium\Datasheets\PESD3V3L5UY.pdf; Author: CERN DEM WB; CreateDate: 05/07/2021; LatestRevisionDate: 05/07/2021
IC8 = XCAU10P-2FFVB676I: Artix UltraScale + Field Programmable Gate Array (FPGA), 676-Pin BGA, Industrial Grade; Manufacturer: AMD; PressFit: No; Bonding: No; Part Number: XCAU10P-2FFVB676I; Component Kind: Standard; Component Type: Standard; Device: XCAU10P-2FFVB676I; PackageDescription: BGA, 1.00mm Pitch, Square; 672 Pin, 26 Columns X 26 Rows, Body 27.00mm X 27.00mm X 3.50mm H, IPC Medium Density; Part Description: Artix UltraScale + Field Programmable Gate Array (FPGA), 676-Pin BGA, Industrial Grade; Manufacturer Part Number: XCAU10P-2FFVB676I; Pin Count: 676; Case: BGA676; Mounted: Yes; Socket: No; SMD: Yes; Sense: No; ComponentHeight: 3.50mm; HelpURL: \\cern.ch\dfs\Applications\Altium\Datasheets\XCAU10P-2FFVB676I.pdf; ComponentLink1URL: \\cern.ch\dfs\Applications\Altium\Datasheets\XCAU10P-2FFVB676I_Package.pdf; ComponentLink1Description: Package Drawing; ComponentLink2URL: \\cern.ch\dfs\Applications\Altium\Datasheets\XCAU10P-2FFVB676I_Pinout.pdf; ComponentLink2Description: Pinout; Author: CERN DEM HF; CreateDate: 10.02.2025; LatestRevisionDate: 10.02.2025
J2 = SAMTEC_TSW-104-07-L-S-LL: Connector 4 Male; Part Description: 4 Contacts, Pitch 2.54mm, Single Row  Through Mount Straigh Header (Post Lead 5.84mm, Tail Lead 2.54mm, Insulator 2.54mm); Manufacturer: SAMTEC; PressFit: No; Part Number: SAMTEC_TSW-104-07-L-S-LL; Component Kind: Standard; Component Type: Standard; Pin Count: 4; Family: Header 4; Mounted: Yes; Socket: No; SMD: No; Sense: No; Status: None; Manufacturer Part Number: TSW-104-07-L-S-LL; ComponentHeight: 8.38mm; HelpURL: \\cern.ch\dfs\Applications\Altium\Datasheets\SAMTEC_TSW-104-07-L-S-LL.pdf; Author: CERN DEM MR; CreateDate: 07.12.2016; LatestRevisionDate: 07.12.2016
OSC1 = OSC_25MHZ_ECS_ECS-3518-250-B: Oscillator 4 pins 1=E/D 2=GND 3=OUT 4=VDD; Part Description: 1.8V, ±50ppm, 15pF, -0 to 70°C, Surface Mount Clock Oscillator (ECS-3518/3525 Series); Manufacturer: ECS; PressFit: No; Bonding: No; Part Number: OSC_25MHZ_ECS_ECS-3518-250-B; Component Kind: Standard; Component Type: Standard; PackageDescription: Oscillator, Corner Concave, 2.50mm Pitch, 4 Pin, 3.20mm L X 5.00mm W X 1.30mm H, ECS-3518 Series; Value: 25MHz; Manufacturer Part Number: ECS-3518-250-B; Pin Count: 4; Mounted: Yes; Socket: No; SMD: Yes; Sense: No; ComponentHeight: 1.3mm; HelpURL: \\cern.ch\dfs\Applications\Altium\Datasheets\OSC_ECS_ECS-3518.pdf; Author: CERN DEM JLC; CreateDate: 14.08.2017; LatestRevisionDate: 14.08.2017
TP5 TP6 = SMD_PAD_1.27X1.27MM: Part Description: 1.27mm x 1.27mm PCB Copper Area (SMD Test Point); Mounted: No; Part Number: SMD_PAD_1.27X1.27MM; Component Kind: Standard (No BOM); Component Type: Standard (No BOM); Pin Count: 1; Family: Test Point; Socket: No; SMD: Yes; Sense: No; Status: None; ComponentHeight: 0mm; HelpURL: Undefined; Author: CERN DEM JLC; CreateDate: 12.01.2008; LatestRevisionDate: 12.01.2008; PackageDescription: 1.27mm x 1.27mm PCB Copper Area (SMD Test Point)